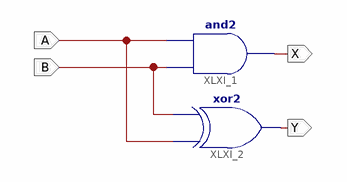
[diagram p0: schematic sheet 1]
// Xilinx ISE schematic LAB05_01.sch (spartan6) as structural Verilog: 2 symbols, 4 ports
module LAB05_01 (
  input  B,
  input  A,
  output X,
  output Y
);

  and XLXI_1 (X, B, A);
  xor XLXI_2 (Y, A, B);
endmodule
